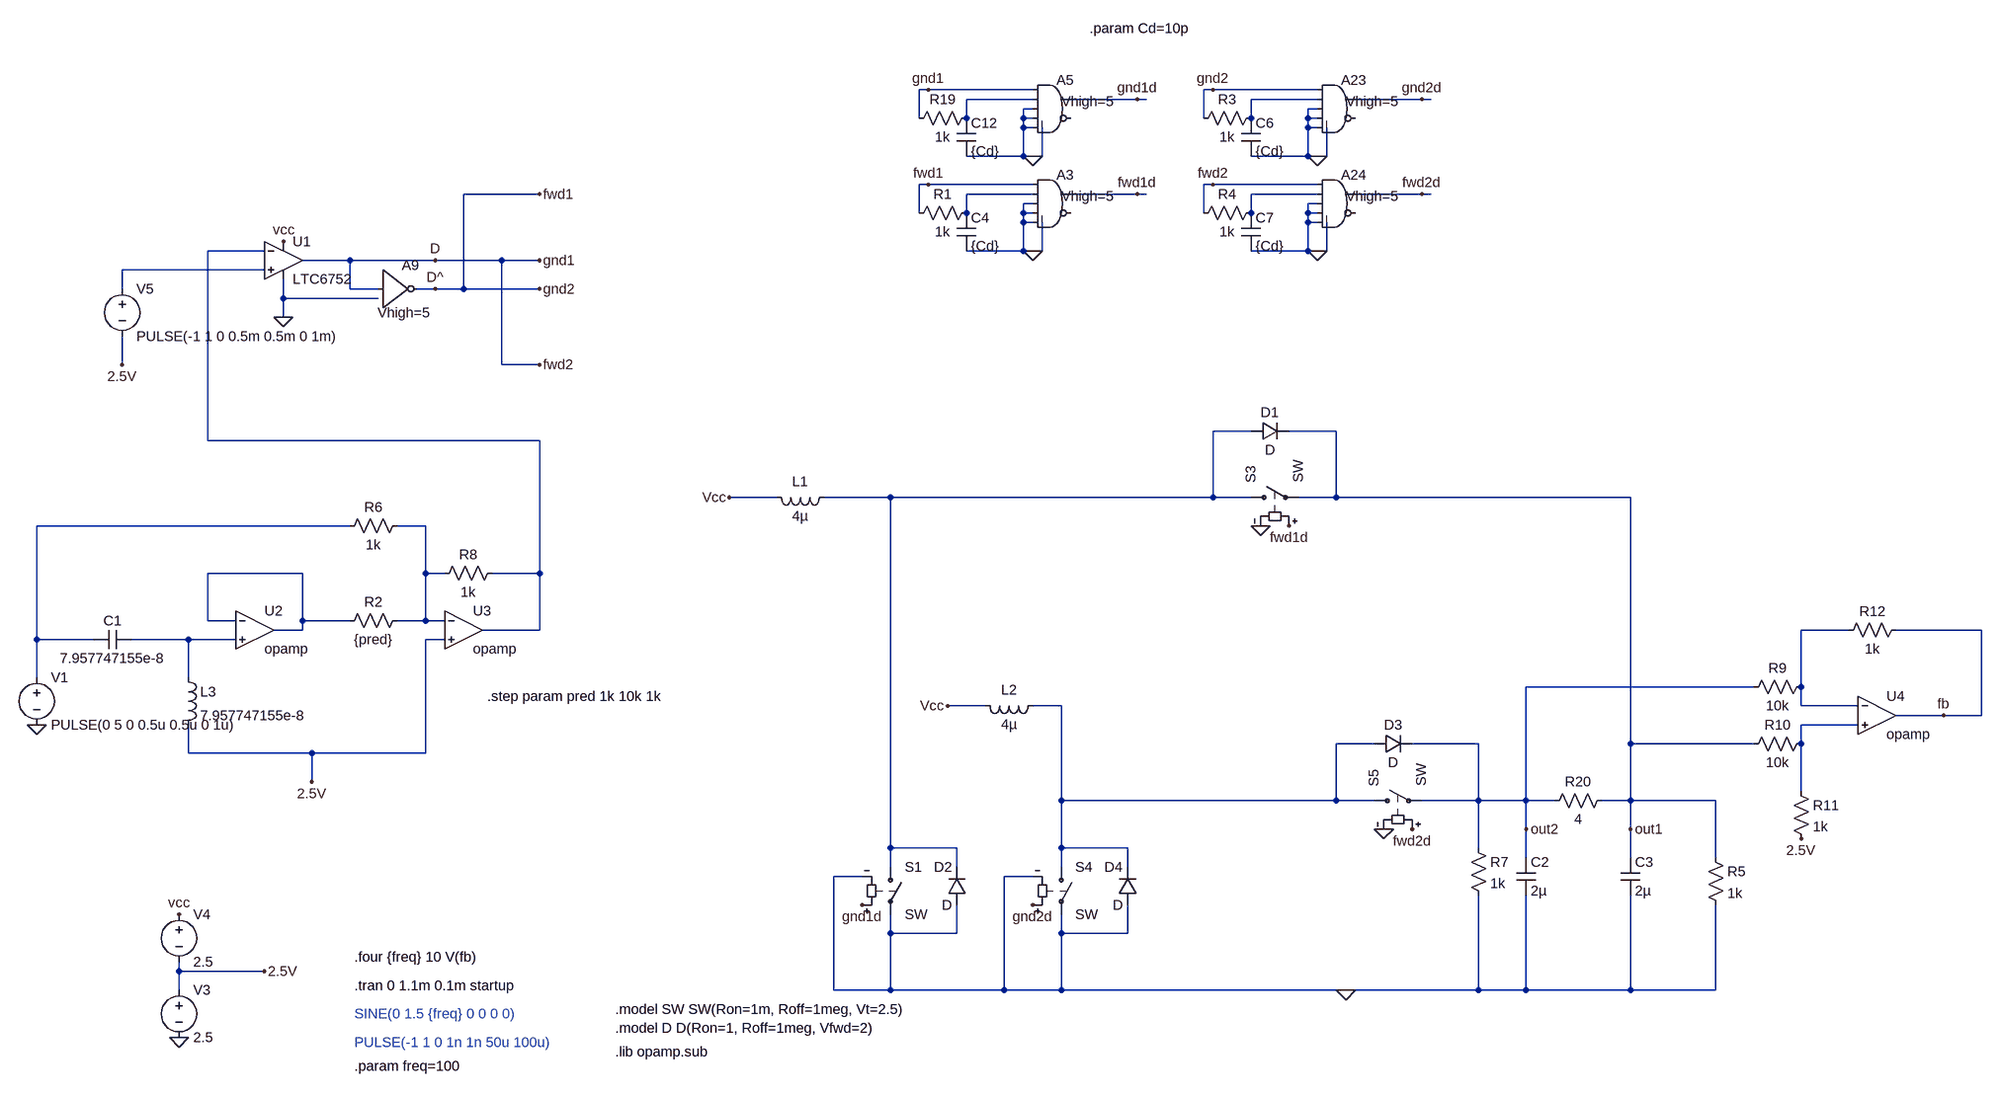
[diagram p0: schematic predistortion.asc]
predistortion.asc, the LTspice schematic file:
Version 4
SHEET 1 3908 980
WIRE 2128 -880 2112 -880
WIRE 2304 -880 2128 -880
WIRE 2608 -880 2592 -880
WIRE 2784 -880 2608 -880
WIRE 2304 -864 2192 -864
WIRE 2480 -864 2368 -864
WIRE 2496 -864 2480 -864
WIRE 2784 -864 2672 -864
WIRE 2960 -864 2848 -864
WIRE 2976 -864 2960 -864
WIRE 2304 -848 2288 -848
WIRE 2784 -848 2768 -848
WIRE 2112 -832 2112 -880
WIRE 2192 -832 2192 -864
WIRE 2288 -832 2288 -848
WIRE 2304 -832 2288 -832
WIRE 2592 -832 2592 -880
WIRE 2672 -832 2672 -864
WIRE 2768 -832 2768 -848
WIRE 2784 -832 2768 -832
WIRE 2288 -816 2288 -832
WIRE 2304 -816 2288 -816
WIRE 2768 -816 2768 -832
WIRE 2784 -816 2768 -816
WIRE 2288 -768 2288 -816
WIRE 2288 -768 2192 -768
WIRE 2304 -768 2288 -768
WIRE 2320 -768 2320 -816
WIRE 2320 -768 2304 -768
WIRE 2768 -768 2768 -816
WIRE 2768 -768 2672 -768
WIRE 2784 -768 2768 -768
WIRE 2800 -768 2800 -816
WIRE 2800 -768 2784 -768
WIRE 2128 -720 2112 -720
WIRE 2304 -720 2128 -720
WIRE 2608 -720 2592 -720
WIRE 2784 -720 2608 -720
WIRE 1472 -704 1344 -704
WIRE 2304 -704 2192 -704
WIRE 2480 -704 2368 -704
WIRE 2496 -704 2480 -704
WIRE 2784 -704 2672 -704
WIRE 2960 -704 2848 -704
WIRE 2976 -704 2960 -704
WIRE 2304 -688 2288 -688
WIRE 2784 -688 2768 -688
WIRE 2112 -672 2112 -720
WIRE 2192 -672 2192 -704
WIRE 2288 -672 2288 -688
WIRE 2304 -672 2288 -672
WIRE 2592 -672 2592 -720
WIRE 2672 -672 2672 -704
WIRE 2768 -672 2768 -688
WIRE 2784 -672 2768 -672
WIRE 2288 -656 2288 -672
WIRE 2304 -656 2288 -656
WIRE 2768 -656 2768 -672
WIRE 2784 -656 2768 -656
WIRE 1008 -608 912 -608
WIRE 2288 -608 2288 -656
WIRE 2288 -608 2192 -608
WIRE 2304 -608 2288 -608
WIRE 2320 -608 2320 -656
WIRE 2320 -608 2304 -608
WIRE 2768 -608 2768 -656
WIRE 2768 -608 2672 -608
WIRE 2784 -608 2768 -608
WIRE 2800 -608 2800 -656
WIRE 2800 -608 2784 -608
WIRE 1152 -592 1072 -592
WIRE 1296 -592 1152 -592
WIRE 1408 -592 1296 -592
WIRE 1472 -592 1408 -592
WIRE 1008 -576 768 -576
WIRE 768 -544 768 -576
WIRE 1152 -544 1152 -592
WIRE 1200 -544 1152 -544
WIRE 1296 -544 1264 -544
WIRE 1344 -544 1344 -704
WIRE 1344 -544 1296 -544
WIRE 1472 -544 1344 -544
WIRE 1040 -528 1040 -560
WIRE 1200 -528 1040 -528
WIRE 1040 -496 1040 -528
WIRE 768 -416 768 -464
WIRE 1408 -416 1408 -592
WIRE 1472 -416 1408 -416
WIRE 2672 -304 2608 -304
WIRE 2816 -304 2736 -304
WIRE 912 -288 912 -608
WIRE 1472 -288 912 -288
WIRE 1872 -192 1792 -192
WIRE 2064 -192 1952 -192
WIRE 2608 -192 2608 -304
WIRE 2608 -192 2064 -192
WIRE 2672 -192 2608 -192
WIRE 2816 -192 2816 -304
WIRE 2816 -192 2752 -192
WIRE 3312 -192 2816 -192
WIRE 1152 -144 624 -144
WIRE 1280 -144 1232 -144
WIRE 1072 -64 912 -64
WIRE 1280 -64 1280 -144
WIRE 1312 -64 1280 -64
WIRE 1472 -64 1472 -288
WIRE 1472 -64 1392 -64
WIRE 912 16 912 -64
WIRE 960 16 912 16
WIRE 1072 16 1072 -64
WIRE 1152 16 1072 16
WIRE 1280 16 1280 -64
WIRE 1280 16 1232 16
WIRE 1312 16 1280 16
WIRE 1072 32 1072 16
WIRE 1072 32 1024 32
WIRE 1472 32 1472 -64
WIRE 1472 32 1376 32
WIRE 3680 32 3600 32
WIRE 3904 32 3760 32
WIRE 624 48 624 -144
WIRE 720 48 624 48
WIRE 880 48 784 48
WIRE 960 48 880 48
WIRE 1312 48 1280 48
WIRE 624 112 624 48
WIRE 880 112 880 48
WIRE 3520 128 3136 128
WIRE 3600 128 3600 32
WIRE 2224 160 2160 160
WIRE 2352 160 2304 160
WIRE 3600 160 3600 128
WIRE 3696 160 3600 160
WIRE 3840 176 3760 176
WIRE 3904 176 3904 32
WIRE 3904 176 3840 176
WIRE 3696 192 3600 192
WIRE 2880 224 2816 224
WIRE 3056 224 2944 224
WIRE 3312 224 3312 -192
WIRE 3520 224 3312 224
WIRE 3600 224 3600 192
WIRE 880 240 880 192
WIRE 1088 240 880 240
WIRE 1280 240 1280 48
WIRE 1280 240 1088 240
WIRE 1088 288 1088 240
WIRE 3600 304 3600 224
WIRE 2352 320 2352 160
WIRE 2816 320 2816 224
WIRE 2816 320 2352 320
WIRE 2880 320 2816 320
WIRE 3056 320 3056 224
WIRE 3056 320 2960 320
WIRE 3136 320 3136 128
WIRE 3136 320 3056 320
WIRE 3184 320 3136 320
WIRE 3312 320 3312 224
WIRE 3312 320 3264 320
WIRE 3456 320 3312 320
WIRE 3136 368 3136 320
WIRE 3312 368 3312 320
WIRE 2064 400 2064 -192
WIRE 2176 400 2064 400
WIRE 2352 400 2352 320
WIRE 2464 400 2352 400
WIRE 3056 400 3056 320
WIRE 3136 416 3136 368
WIRE 3312 416 3312 368
WIRE 3456 416 3456 320
WIRE 2064 432 2064 400
WIRE 2176 432 2176 400
WIRE 2352 432 2352 400
WIRE 2464 432 2464 400
WIRE 2016 448 1968 448
WIRE 2304 448 2256 448
WIRE 2064 544 2064 512
WIRE 2176 544 2176 496
WIRE 2176 544 2064 544
WIRE 2352 544 2352 512
WIRE 2464 544 2464 496
WIRE 2464 544 2352 544
WIRE 864 608 864 592
WIRE 1008 608 864 608
WIRE 864 640 864 608
WIRE 1968 640 1968 448
WIRE 2064 640 2064 544
WIRE 2064 640 1968 640
WIRE 2256 640 2256 448
WIRE 2256 640 2064 640
WIRE 2352 640 2352 544
WIRE 2352 640 2256 640
WIRE 2832 640 2352 640
WIRE 3056 640 3056 480
WIRE 3056 640 2832 640
WIRE 3136 640 3136 480
WIRE 3136 640 3056 640
WIRE 3312 640 3312 480
WIRE 3312 640 3136 640
WIRE 3456 640 3456 496
WIRE 3456 640 3312 640
FLAG 624 192 0
FLAG 864 720 0
FLAG 864 512 vcc
FLAG 1040 -624 vcc
FLAG 1040 -496 0
FLAG 2832 640 0
FLAG 1792 -192 Vcc
FLAG 2160 160 Vcc
FLAG 2688 -144 0
FLAG 2896 368 0
FLAG 1296 -592 D
FLAG 1296 -544 D^
FLAG 2304 -768 0
FLAG 1008 608 2.5V
FLAG 1472 -592 gnd1
FLAG 1472 -704 fwd1
FLAG 1472 -544 gnd2
FLAG 2304 -608 0
FLAG 2784 -768 0
FLAG 2784 -608 0
FLAG 2128 -880 gnd1
FLAG 2128 -720 fwd1
FLAG 2608 -880 gnd2
FLAG 2608 -720 fwd2
FLAG 2480 -864 gnd1d
FLAG 2480 -704 fwd1d
FLAG 2960 -864 gnd2d
FLAG 2960 -704 fwd2d
FLAG 2016 496 gnd1d
FLAG 2304 496 gnd2d
FLAG 2736 -144 fwd1d
FLAG 2944 368 fwd2d
FLAG 3600 384 2.5V
FLAG 3840 176 fb
FLAG 768 -416 2.5V
FLAG 3312 368 out1
FLAG 3136 368 out2
FLAG 1472 -416 fwd2
FLAG 1088 288 2.5V
SYMBOL voltage 624 96 R0
WINDOW 123 0 0 Left 2
WINDOW 39 0 0 Left 2
SYMATTR InstName V1
SYMATTR Value PULSE(0 5 0 0.5u 0.5u 0 1u)
SYMBOL Comparators\\LTC6752 1040 -656 R0
SYMATTR InstName U1
SYMBOL voltage 864 496 R0
WINDOW 123 0 0 Left 2
WINDOW 39 0 0 Left 2
SYMATTR InstName V4
SYMATTR Value 2.5
SYMBOL ind 1968 -208 R90
WINDOW 0 5 56 VBottom 2
WINDOW 3 32 56 VTop 2
SYMATTR InstName L1
SYMATTR Value 4µ
SYMBOL cap 3120 416 R0
SYMATTR InstName C2
SYMATTR Value 2µ
SYMBOL cap 3296 416 R0
SYMATTR InstName C3
SYMATTR Value 2µ
SYMBOL sw 2064 416 R0
SYMATTR InstName S1
SYMBOL sw 2656 -192 R270
SYMATTR InstName S3
SYMBOL diode 2192 496 R180
WINDOW 0 24 64 Left 2
WINDOW 3 24 0 Left 2
SYMATTR InstName D2
SYMBOL sw 2352 416 R0
SYMATTR InstName S4
SYMBOL diode 2480 496 R180
WINDOW 0 24 64 Left 2
WINDOW 3 24 0 Left 2
SYMATTR InstName D4
SYMBOL sw 2864 320 R270
SYMATTR InstName S5
SYMBOL ind 2320 144 R90
WINDOW 0 5 56 VBottom 2
WINDOW 3 32 56 VTop 2
SYMATTR InstName L2
SYMATTR Value 4µ
SYMBOL Digital\\inv 1200 -608 R0
WINDOW 3 -1 104 Left 2
SYMATTR Value Vhigh=5
SYMATTR InstName A9
SYMBOL res 3440 400 R0
SYMATTR InstName R5
SYMATTR Value 1k
SYMBOL res 3040 384 R0
SYMATTR InstName R7
SYMATTR Value 1k
SYMBOL Digital\\and 2336 -912 R0
WINDOW 3 16 52 Left 2
SYMATTR Value Vhigh=5
SYMATTR InstName A5
SYMBOL res 2208 -848 R90
WINDOW 0 0 56 VBottom 2
WINDOW 3 32 56 VTop 2
SYMATTR InstName R19
SYMATTR Value 1k
SYMBOL cap 2176 -832 R0
SYMATTR InstName C12
SYMATTR Value {Cd}
SYMBOL res 3280 304 R90
WINDOW 0 0 56 VBottom 2
WINDOW 3 32 56 VTop 2
SYMATTR InstName R20
SYMATTR Value 4
SYMBOL voltage 864 624 R0
WINDOW 123 0 0 Left 2
WINDOW 39 0 0 Left 2
SYMATTR InstName V3
SYMATTR Value 2.5
SYMBOL diode 2672 -288 R270
WINDOW 0 32 32 VTop 2
WINDOW 3 0 32 VBottom 2
SYMATTR InstName D1
SYMBOL diode 2880 240 R270
WINDOW 0 32 32 VTop 2
WINDOW 3 0 32 VBottom 2
SYMATTR InstName D3
SYMBOL Digital\\and 2336 -752 R0
WINDOW 3 16 52 Left 2
SYMATTR Value Vhigh=5
SYMATTR InstName A3
SYMBOL res 2208 -688 R90
WINDOW 0 0 56 VBottom 2
WINDOW 3 32 56 VTop 2
SYMATTR InstName R1
SYMATTR Value 1k
SYMBOL cap 2176 -672 R0
SYMATTR InstName C4
SYMATTR Value {Cd}
SYMBOL Digital\\and 2816 -912 R0
WINDOW 3 16 52 Left 2
SYMATTR Value Vhigh=5
SYMATTR InstName A23
SYMBOL res 2688 -848 R90
WINDOW 0 0 56 VBottom 2
WINDOW 3 32 56 VTop 2
SYMATTR InstName R3
SYMATTR Value 1k
SYMBOL cap 2656 -832 R0
SYMATTR InstName C6
SYMATTR Value {Cd}
SYMBOL Digital\\and 2816 -752 R0
WINDOW 3 16 52 Left 2
SYMATTR Value Vhigh=5
SYMATTR InstName A24
SYMBOL res 2688 -688 R90
WINDOW 0 0 56 VBottom 2
WINDOW 3 32 56 VTop 2
SYMATTR InstName R4
SYMATTR Value 1k
SYMBOL cap 2656 -672 R0
SYMATTR InstName C7
SYMATTR Value {Cd}
SYMBOL Opamps\\opamp 3728 112 R0
SYMATTR InstName U4
SYMBOL res 3616 112 R90
WINDOW 0 0 56 VBottom 2
WINDOW 3 32 56 VTop 2
SYMATTR InstName R9
SYMATTR Value 10k
SYMBOL res 3616 208 R90
WINDOW 0 0 56 VBottom 2
WINDOW 3 32 56 VTop 2
SYMATTR InstName R10
SYMATTR Value 10k
SYMBOL res 3584 288 R0
SYMATTR InstName R11
SYMATTR Value 1k
SYMBOL res 3776 16 R90
WINDOW 0 0 56 VBottom 2
WINDOW 3 32 56 VTop 2
SYMATTR InstName R12
SYMATTR Value 1k
SYMBOL voltage 768 -560 R0
WINDOW 123 0 0 Left 2
WINDOW 39 0 0 Left 2
SYMATTR InstName V5
SYMATTR Value PULSE(-1 1 0 0.5m 0.5m 0 1m)
SYMBOL ind 864 96 R0
SYMATTR InstName L3
SYMATTR Value 7.957747155e-8
SYMATTR SpiceLine Rser=100m
SYMBOL cap 784 32 R90
WINDOW 0 0 32 VBottom 2
WINDOW 3 32 32 VTop 2
SYMATTR InstName C1
SYMATTR Value 7.957747155e-8
SYMBOL Opamps\\opamp 992 -32 R0
SYMATTR InstName U2
SYMBOL Opamps\\opamp 1344 -32 R0
SYMATTR InstName U3
SYMBOL res 1248 0 R90
WINDOW 0 0 56 VBottom 2
WINDOW 3 32 56 VTop 2
SYMATTR InstName R2
SYMATTR Value {pred}
SYMBOL res 1248 -160 R90
WINDOW 0 0 56 VBottom 2
WINDOW 3 32 56 VTop 2
SYMATTR InstName R6
SYMATTR Value 1k
SYMBOL res 1408 -80 R90
WINDOW 0 0 56 VBottom 2
WINDOW 3 32 56 VTop 2
SYMATTR InstName R8
SYMATTR Value 1k
TEXT 1160 632 Left 2 !.tran 0 1.1m 0.1m startup
TEXT 1600 672 Left 2 !.model SW SW(Ron=1m, Roff=1meg, Vt=2.5)
TEXT 1600 704 Left 2 !.model D D(Ron=1, Roff=1meg, Vfwd=2)
TEXT 2400 -984 Left 2 !.param Cd=10p
TEXT 1600 744 Left 2 !.lib opamp.sub
TEXT 1160 680 Left 2 ;SINE(0 1.5 {freq} 0 0 0 0)
TEXT 1160 728 Left 2 ;PULSE(-1 1 0 1n 1n 50u 100u)
TEXT 1160 584 Left 2 !.four {freq} 10 V(fb)
TEXT 1160 768 Left 2 !.param freq=100
TEXT 1384 144 Left 2 !.step param pred 1k 10k 1k

The netlist it stands for:
* predistortion.asc
V1 N008 0 PULSE(0 5 0 0.5u 0.5u 0 1u)
XU1 N006 N005 vcc 0 fwd2 LTC6752  ; pins In+ In- V+ V- OUT
V4 vcc 2.5V 2.5
L1 N007 vcc 4µ
C2 out2 0 2µ
C3 out1 0 2µ
S1 N007 0 gnd1d 0 SW
S3 N007 out1 fwd1d 0 SW
D2 0 N007 D
S4 N013 0 gnd2d 0 SW
D4 0 N013 D
S5 N013 out2 fwd2d 0 SW
L2 N013 vcc 4µ
A9 fwd2 0 0 0 0 gnd2 0 0 BUF Vhigh=5
R5 out1 0 1k
R7 out2 0 1k
A5 fwd2 N001 0 0 0 0 gnd1d 0 AND Vhigh=5
R19 N001 fwd2 1k
C12 N001 0 {Cd}
R20 out1 out2 4
V3 2.5V 0 2.5
D1 N007 out1 D
D3 N013 out2 D
A3 gnd2 N003 0 0 0 0 fwd1d 0 AND Vhigh=5
R1 N003 gnd2 1k
C4 N003 0 {Cd}
A23 gnd2 N002 0 0 0 0 gnd2d 0 AND Vhigh=5
R3 N002 gnd2 1k
C6 N002 0 {Cd}
A24 fwd2 N004 0 0 0 0 fwd2d 0 AND Vhigh=5
R4 N004 fwd2 1k
C7 N004 0 {Cd}
XU4 N011 N014 fb opamp Aol=100K GBW=10Meg  ; pins invin noninvin out
R9 N011 out2 10k
R10 N014 out1 10k
R11 N014 2.5V 1k
R12 fb N011 1k
V5 N006 2.5V PULSE(-1 1 0 0.5m 0.5m 0 1m)
L3 N012 2.5V 7.957747155e-8 Rser=100m
C1 N012 N008 7.957747155e-8
XU2 N010 N012 N010 opamp Aol=100K GBW=10Meg  ; pins invin noninvin out
XU3 N009 2.5V N005 opamp Aol=100K GBW=10Meg  ; pins invin noninvin out
R2 N009 N010 {pred}
R6 N009 N008 1k
R8 N005 N009 1k
.model D D
.lib standard.dio
.tran 0 1.1m 0.1m startup
.model SW SW(Ron=1m, Roff=1meg, Vt=2.5)
.model D D(Ron=1, Roff=1meg, Vfwd=2)
.param Cd=10p
.lib opamp.sub
* SINE(0 1.5 {freq} 0 0 0 0)
* PULSE(-1 1 0 1n 1n 50u 100u)
.four {freq} 10 V(fb)
.param freq=100
.step param pred 1k 10k 1k
.lib LTC7.lib
.backanno
.end